# Altium schematic sheet RPI_HAT.SchDoc
size 420 x 297 mm
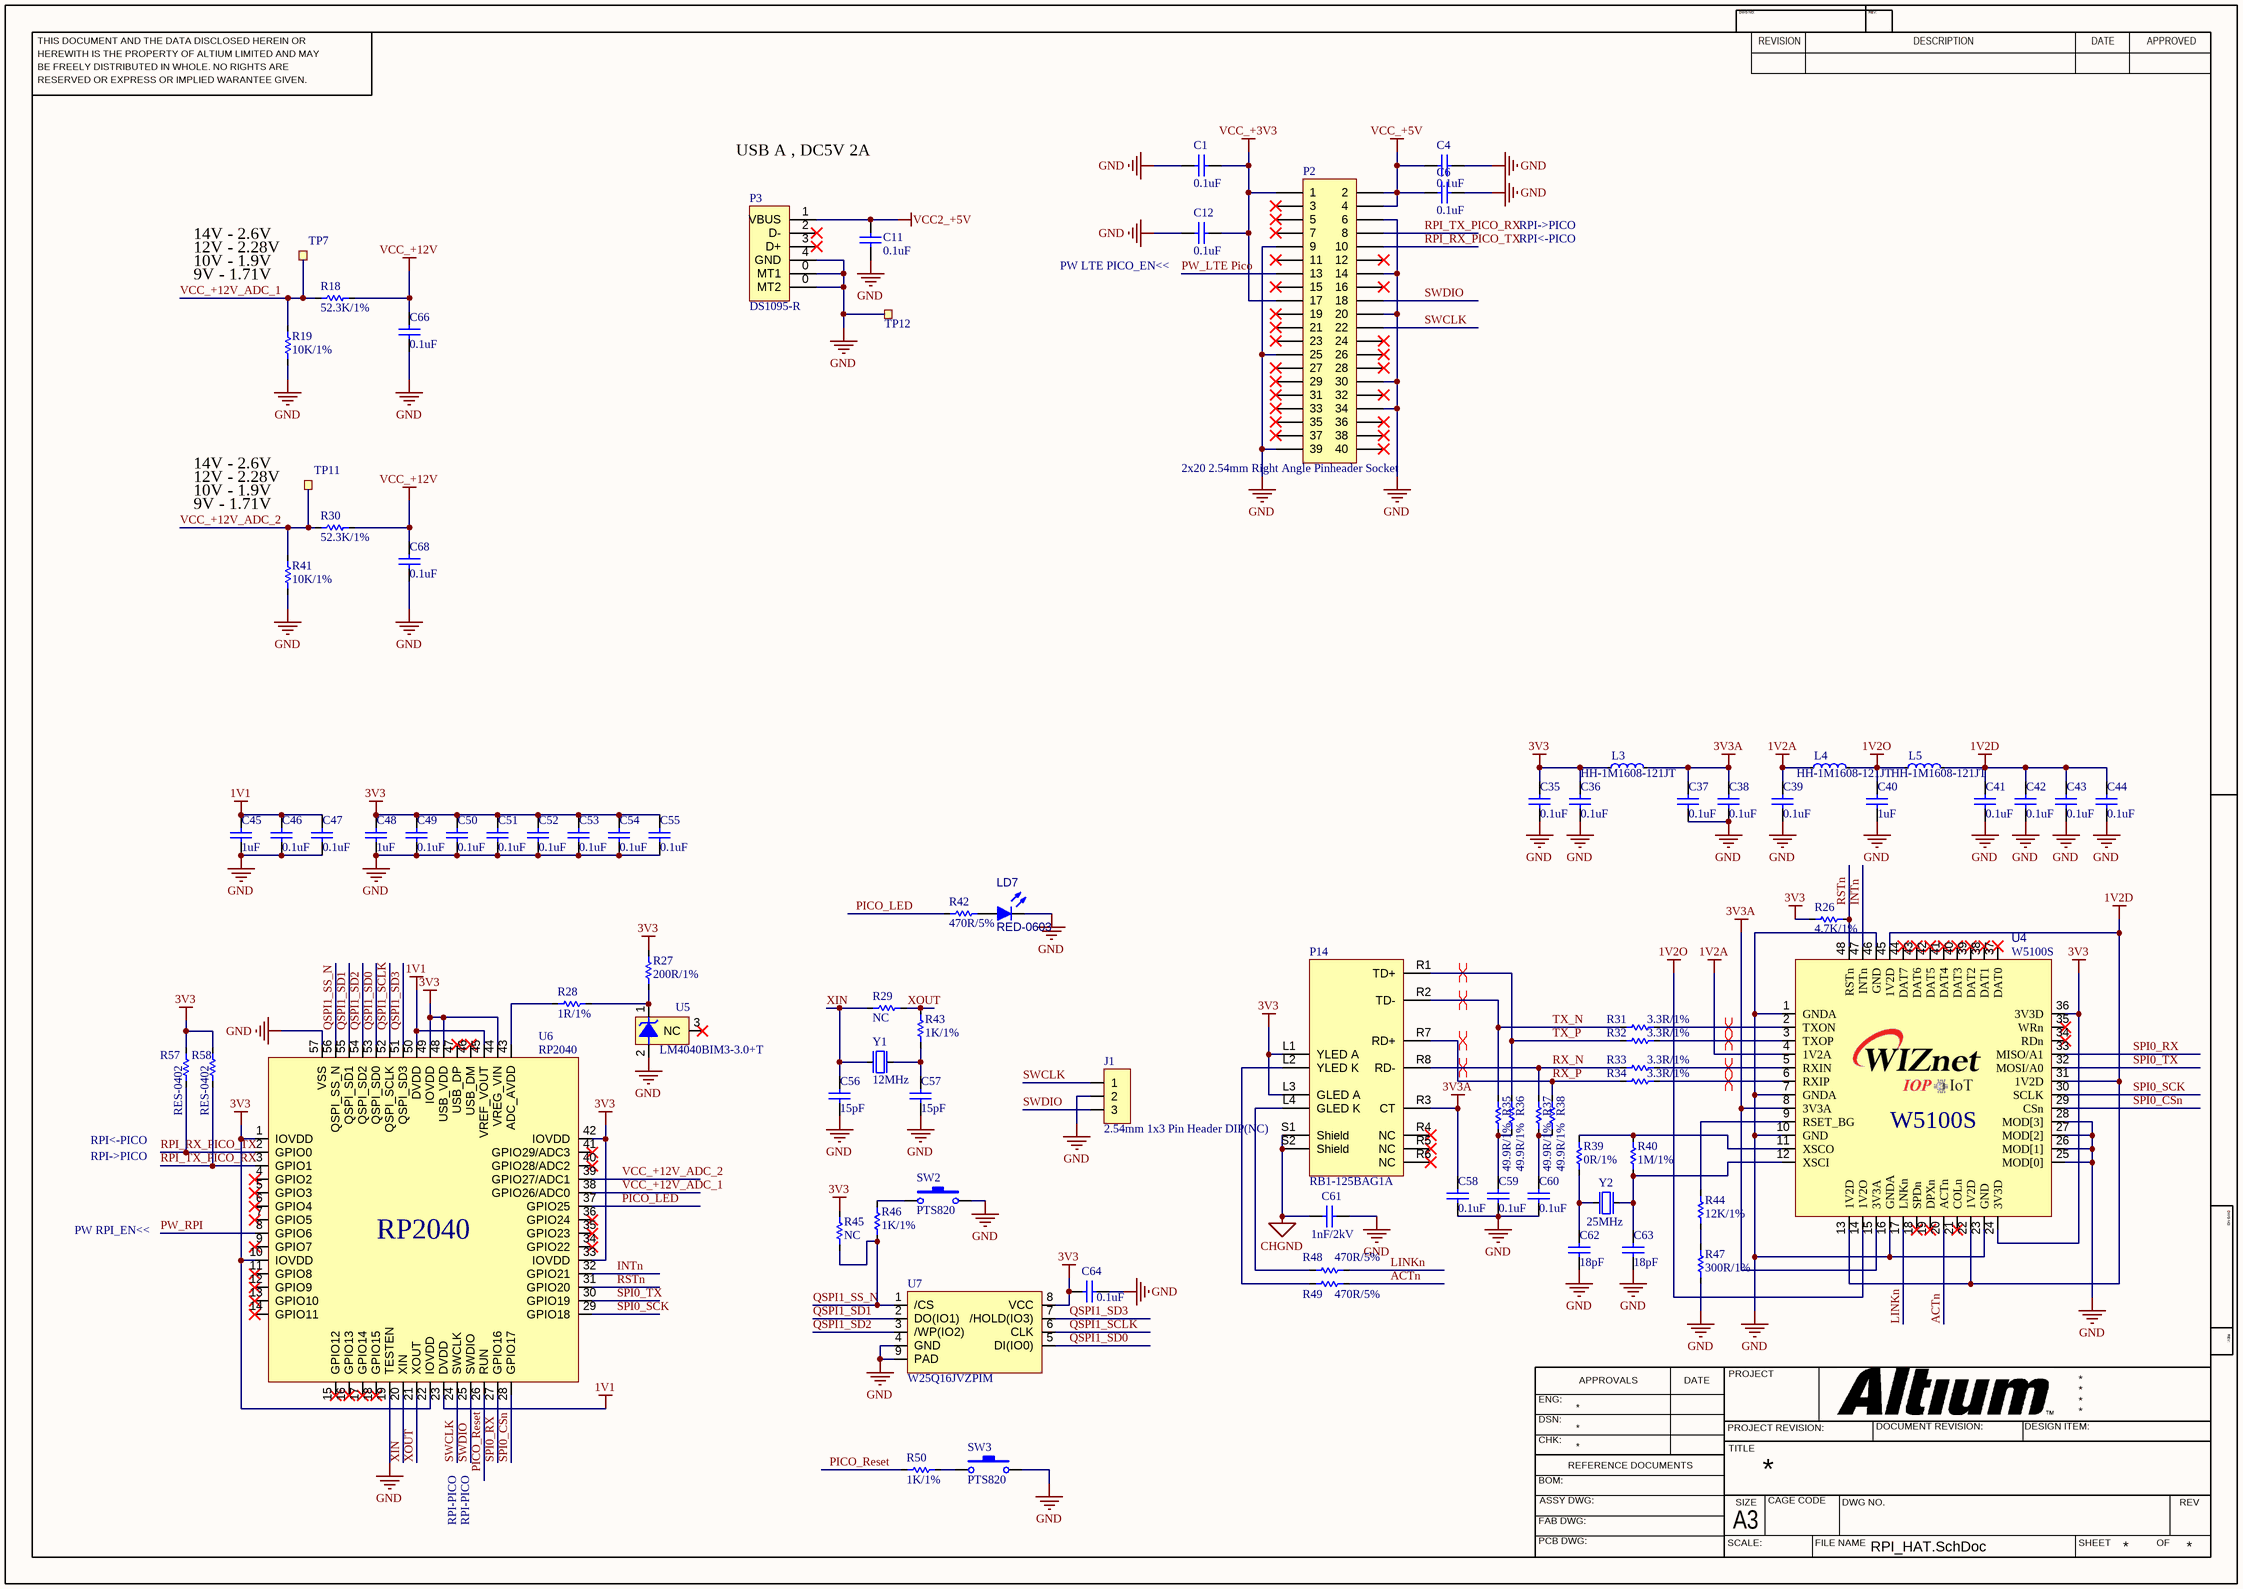
[diagram p0: RPI_HAT.SchDoc]

## Parts
C1  0.1uF  [CAP-0402]
C4  0.1uF  [CAP-0402]
C6  0.1uF  [CAP-0402]
C11  0.1uF  [CAP-0402]
C12  0.1uF  [CAP-0402]
C35  0.1uF  [CAP-0402]
C36  0.1uF  [CAP-0402]
C37  0.1uF  [CAP-0402]
C38  0.1uF  [CAP-0402]
C39  0.1uF  [CAP-0402]
C40  1uF  [CAP-0402]
C41  0.1uF  [CAP-0402]
C42  0.1uF  [CAP-0402]
C43  0.1uF  [CAP-0402]
C44  0.1uF  [CAP-0402]
C45  1uF  [CAP-0402]
C46  0.1uF  [CAP-0402]
C47  0.1uF  [CAP-0402]
C48  1uF  [CAP-0402]
C49  0.1uF  [CAP-0402]
C50  0.1uF  [CAP-0402]
C51  0.1uF  [CAP-0402]
C52  0.1uF  [CAP-0402]
C53  0.1uF  [CAP-0402]
C54  0.1uF  [CAP-0402]
C55  0.1uF  [CAP-0402]
C56  15pF  [CAP-0402]
C57  15pF  [CAP-0402]
C58  0.1uF  [CAP-0402]
C59  0.1uF  [CAP-0402]
C60  0.1uF  [CAP-0402]
C61  1nF/2kV  [CAP-1808]
C62  18pF  [CAP-0402]
C63  18pF  [CAP-0402]
C64  0.1uF  [CAP-0402]
C66  0.1uF  [CAP-0402]
C68  0.1uF  [CAP-0402]
J1  2.54mm 1x3 Pin Header DIP(NC)  [IDC-1X3]
L3  HH-1M1608-121JT  [IND-0603]
L4  HH-1M1608-121JT  [IND-0603]
L5  HH-1M1608-121JT  [IND-0603]
LD7  RED-0603  [LED-0603-RED]
P2  2x20 2.54mm Right Angle Pinheader Socket  [IDC-2X20-RA]
P3  DS1095-R  [DS1095-R]
P14  RB1-125BAG1A  [RB1-125BAG1A]
R18  52.3K/1%  [RES-0402]
R19  10K/1%  [RES-0402]
R26  4.7K/1%  [RES-0402]
R27  200R/1%  [RES-0402]
R28  1R/1%  [RES-0402]
R29  NC  [RES-0402]
R30  52.3K/1%  [RES-0402]
R31  3.3R/1%  [RES-0402]
R32  3.3R/1%  [RES-0402]
R33  3.3R/1%  [RES-0402]
R34  3.3R/1%  [RES-0402]
R35  49.9R/1%  [RES-0402]
R36  49.9R/1%  [RES-0402]
R37  49.9R/1%  [RES-0402]
R38  49.9R/1%  [RES-0402]
R39  0R/1%  [RES-0402]
R40  1M/1%  [RES-0402]
R41  10K/1%  [RES-0402]
R42  470R/5%  [RES-0402]
R43  1K/1%  [RES-0402]
R44  12K/1%  [RES-0402]
R45  NC  [RES-0402]
R46  1K/1%  [RES-0402]
R47  300R/1%  [RES-0402]
R48  470R/5%  [RES-0402]
R49  470R/5%  [RES-0402]
R50  1K/1%  [RES-0402]
R57  RES-0402  [RES-0402]
R58  RES-0402  [RES-0402]
SW2  PTS820  [PTS820]
SW3  PTS820  [PTS820]
TP7  TESTPOINT  [TP(SMD)-1PI]  (value not drawn)
TP11  TESTPOINT  [TP(SMD)-1PI]  (value not drawn)
TP12  TESTPOINT  [TP(SMD)-1PI]  (value not drawn)
U4  W5100S  [LQFP48(0.5/9.0)]
U5  LM4040BIM3-3.0+T  [SOT-23-3L]
U6  RP2040  [QFN56(0.4/7X7)]
U7  W25Q16JVZPIM  [WSON8(6X5_1.27)]
Y1  12MHz  [OSC-S3225A]
Y2  25MHz  [OSC-S3225A]

## Nets
1V1: C45.2 C46.2 C47.2 U6.23(DVDD) U6.45(VREF_VOUT) U6.50(DVDD)
1V2A: C39.2 L4.1 U4.4(1V2A)
1V2D: C41.2 C42.2 C43.2 C44.2 L5.2 U4.13(1V2D) U4.22(1V2D) U4.31(1V2D) U4.45(1V2D)
1V2O: C40.2 L4.2 L5.1 U4.14(1V2O)
3V3: C35.2 C36.2 C48.2 C49.2 C50.2 C51.2 C52.2 C53.2 C54.2 C55.2 C64.2 L3.1 P14.L1(YLED_A) P14.L3(GLED_A) R26.1 R27.1 R45.2 R57.2 R58.2 U4.24(3V3D) U4.36(3V3D) U6.1(IOVDD) U6.10(IOVDD) U6.22(IOVDD) U6.33(IOVDD) U6.42(IOVDD) U6.44(VREG_VIN) U6.48(USB_VDD) U6.49(IOVDD) U7.8(VCC)
3V3A: C37.2 C38.2 C58.2 L3.2 P14.R3(CT) U4.8(3V3A) U4.15(3V3A)
CHGND: C61.2 P14.S1(Shield) P14.S2(Shield)
GND: C1.2 C4.2 C6.2 C11.2 C12.2 C35.1 C36.1 C37.1 C38.1 C39.1 C40.1 C41.1 C42.1 C43.1 C44.1 C45.1 C46.1 C47.1 C48.1 C49.1 C50.1 C51.1 C52.1 C53.1 C54.1 C55.1 C56.2 C57.2 C58.1 C59.1 C60.1 C61.1 C62.1 C63.1 C64.1 C66.1 C68.1 J1.2 LD7.2(K) P2.6 P2.9 P2.14 P2.20 P2.25 P2.30 P2.34 P2.39 P3.0(MT1) P3.4(GND) R19.1 R41.1 R47.2 SW2.2 SW3.2 TP12.1(TETSPOINT) U4.1(GNDA) U4.7(GNDA) U4.10(GND) U4.16(GNDA) U4.23(GND) U4.25(MOD[0]) U4.26(MOD[1]) U4.27(MOD[2]) U4.28(MOD[3]) U4.46(GND) U5.2(-V) U6.19(TESTEN) U6.57(VSS) U7.4(GND) U7.9(PAD) Y1.2 Y1.4 Y2.2(GND) Y2.4(GND)
VCC2_+5V: C11.1 P3.1(VBUS)
VCC_+3V3: C1.1 C12.1 P2.1 P2.17
VCC_+5V: C4.1 C6.1 P2.2 P2.4
VCC_+12V: C66.2 C68.2 R18.1 R30.1
ACTn: R49.2 U4.20(ACTn)
INTn: U4.47(INTn) U6.32(GPIO21)
LINKn: R48.2 U4.17(LNKn)
PICO_LED: R42.1 U6.37(GPIO25)
PICO_Reset: R50.1 U6.26(RUN)
PW_LTE Pico: P2.13
PW_RPI: U6.8(GPIO6)
QSPI1_SCLK: U6.52(QSPI_SCLK) U7.6(CLK)
QSPI1_SD0: U6.53(QSPI_SD0) U7.5(DI(IO0))
QSPI1_SD1: U6.55(QSPI_SD1) U7.2(DO(IO1))
QSPI1_SD2: U6.54(QSPI_SD2) U7.3(/WP(IO2))
QSPI1_SD3: U6.51(QSPI_SD3) U7.7(/HOLD(IO3))
QSPI1_SS_N: R45.1 R46.2 U6.56(QSPI_SS_N) U7.1(/CS)
RPI_RX_PICO_TX: P2.10 R57.1 U6.2(GPIO0)
RPI_TX_PICO_RX: P2.8 R58.1 U6.3(GPIO1)
RSTn: R26.2 U4.48(RSTn) U6.31(GPIO20)
RX_N: P14.R8(RD-) R33.1 R37.2
RX_P: P14.R7(RD+) R34.1 R38.2
SPI0_CSn: U4.29(CSn) U6.28(GPIO17)
SPI0_RX: U4.33(MISO/A1) U6.27(GPIO16)
SPI0_SCK: U4.30(SCLK) U6.29(GPIO18)
SPI0_TX: U4.32(MOSI/A0) U6.30(GPIO19)
SWCLK: J1.1 P2.22 U6.24(SWCLK)
SWDIO: J1.3 P2.18 U6.25(SWDIO)
TX_N: P14.R2(TD-) R31.1 R35.2
TX_P: P14.R1(TD+) R32.1 R36.2
VCC_+12V_ADC_1: R18.2 R19.2 TP7.1(TETSPOINT) U6.38(GPIO26/ADC0)
VCC_+12V_ADC_2: R30.2 R41.2 TP11.1(TETSPOINT) U6.39(GPIO27/ADC1)
XIN: C56.1 R29.2 U6.20(XIN) Y1.1(inp)
XOUT: R29.1 R43.1 U6.21(XOUT)
NetC57_1: C57.1 R43.2 Y1.3(out)
NetC59_2: C59.2 R35.1 R36.1
NetC60_2: C60.2 R37.1 R38.1
NetC62_2: C62.2 R39.1 Y2.1(inp)
NetC63_2: C63.2 R40.1 U4.12(XSCI) Y2.3(out)
NetLD7_1: LD7.1(A) R42.2
NetP14_L2: P14.L2(YLED_K) R49.1
NetP14_L4: P14.L4(GLED_K) R48.1
NetR27_2: R27.2 R28.2 U5.1(+V)
NetR28_1: R28.1 U6.43(ADC_AVDD)
NetR31_2: R31.2 U4.2(TXON)
NetR32_2: R32.2 U4.3(TXOP)
NetR33_2: R33.2 U4.5(RXIN)
NetR34_2: R34.2 U4.6(RXIP)
NetR39_2: R39.2 R40.2 U4.11(XSCO)
NetR44_1: R44.1 U4.9(RSET_BG)
NetR44_2: R44.2 R47.1
NetR46_1: R46.1 SW2.1
NetR50_2: R50.2 SW3.1

Not connected (* = marked no-connect by the designer): P2 3* 5* 7* 11* 12* 15* 16* 19* 21* 23* 24* 26* 27* 28* 29* 31* 32* 33* 35* 36* 37* 38* 40*; P3 2(D-)* 3(D+)*; P14 R4(NC)* R5(NC)* R6(NC)*; U4 18(SPDn)* 19(DPXn)* 21(COLn)* 34(RDn)* 35(WRn)* 37(DAT0)* 38(DAT1)* 39(DAT2)* 40(DAT3)* 41(DAT4)* 42(DAT5)* 43(DAT6)* 44(DAT7)*; U5 3(NC)*; U6 4(GPIO2)* 5(GPIO3)* 6(GPIO4)* 7(GPIO5)* 9(GPIO7)* 11(GPIO8)* 12(GPIO9)* 13(GPIO10)* 14(GPIO11)* 15(GPIO12)* 16(GPIO13)* 17(GPIO14)* 18(GPIO15)* 34(GPIO22)* 35(GPIO23)* 36(GPIO24)* 40(GPIO28/ADC2)* 41(GPIO29/ADC3)* 46(USB_DM)* 47(USB_DP)*

## Layout directives
differential pair: (no net found under the mark), NetR31_2, NetR32_2, NetR33_2, NetR34_2, RX_N, RX_P, TX_N

## Notes on the sheet
- USB A , DC5V 2A
- (near TP7) 12V - 2.28V
- (near TP7) 14V - 2.6V
- RPI->PICO
- RPI<-PICO
- (near TP7) 10V - 1.9V
- (near TP7) 9V - 1.71V
- (near C12) PW LTE PICO_EN<<
- (near TP11) 12V - 2.28V
- (near TP11) 14V - 2.6V
- (near TP11) 10V - 1.9V
- 9V - 1.71V
- PW RPI_EN<<
- RPI-PICO
- THIS DOCUMENT AND THE DATA DISCLOSED HEREIN OR
- HEREWITH IS THE PROPERTY OF ALTIUM LIMITED AND MAY
- DWG NO:
- REVISION
- REV:
- DESCRIPTION
- DATE
- APPROVED
- BE FREELY DISTRIBUTED IN WHOLE. NO RIGHTS ARE
- RESERVED OR EXPRESS OR IMPLIED WARANTEE GIVEN.
- ENG:
- APPROVALS
- PROJECT
- DSN:
- CHK:
- REFERENCE DOCUMENTS
- PROJECT REVISION:
- TITLE
- DOCUMENT REVISION:
- DESIGN ITEM:
- BOM:
- FAB DWG:
- PCB DWG:
- ASSY DWG:
- SCALE:
- A3
- SIZE
- CAGE CODE
- FILE NAME
- DWG NO.
- SHEET
- OF
- REV

## Library data of the parts
C1 C4 C6 C11 C12 C35-C60 C62-C64 C66 C68 = CAP-0402: Ceramic CAP 0402(1005)
C61 = CAP-1808: Ceramic CAP 1808(4520)
J1 = 2.54mm 1x3 Pin Header DIP
L3-L5 = IND-0603: Inductor 0603(1608)
LD7 = LED-0603
P2 = Header 20X2: Header, 20-Pin, Dual row; LatestRevisionDate: 17-Jul-2002; LatestRevisionNote: Re-released for DXP Platform.; Publisher: Altium Limited
P3 = Header 6: Header, 6-Pin; LatestRevisionDate: 17-Jul-2002; LatestRevisionNote: Re-released for DXP Platform.; Publisher: Altium Limited
R18 R19 R26-R50 = RES-0402
R57 R58 = RES-0402: Chip Resistor 0402(1005)
SW2 SW3 = ITS-1107(SMD): TACT Switch (SMD)
TP7 TP11 TP12 = TESTPOINT: TEST POINT
U4 = W5100S: WIZnet Hardwired TCP/IP Chip
U5 = CMP-0074-00612-2: Precision Micropower Shunt Voltage Reference, 3-pin SOT-23, Pb-Free; Manufacturer: National Semiconductor; PackageTopMarking: RKA*XTT; PowerWise: N; CompType: Voltage Reference IC; PackageDescription: Molded SOT-23, .115 x .051 x .037in Body, 3 Lead, .075 in Pitch; DatasheetVersion: Apr-2005; ComponentLink2Description: LM4040 Web Page; PinCount: 3; PackageVersion: revB, Mar-2003; RevisionNote: Component URLs added; ComponentLink3URL: http://www.national.com/packaging/folders/mf03a.html; RoHS: Y; ComponentLink2URL: http://www.national.com/pf/LM/LM4040.html; ComponentLink1Description: LM4040 Datasheet; PackageReference: MF03A; ComponentLink1URL: http://www.national.com/ds/LM/LM4040.pdf; ComponentLink3Description: MF03A Package Page
U6 = RP2040: Raspverry Pi, Dual ARM Cortex-M0+ @ 133MHz
U7 = W25Q16JVZPIM: 3V 16M-BIT / SERIAL FLASH MEMORY WITH / DUAL/QUAD SPI, QPI & DTR
Y1 = OSC-TZ1067B-12MHz: X-tal 12MHz,3.2x2.5 SMD, CL=20pF
Y2 = OSC-82J0626-25MHz: X-tal 25MHz,3.2x2.5 SMD, CL=18pF